# Altium schematic sheet NCS_Wireless_Control_Card_Display_Connector.SchDoc
size A
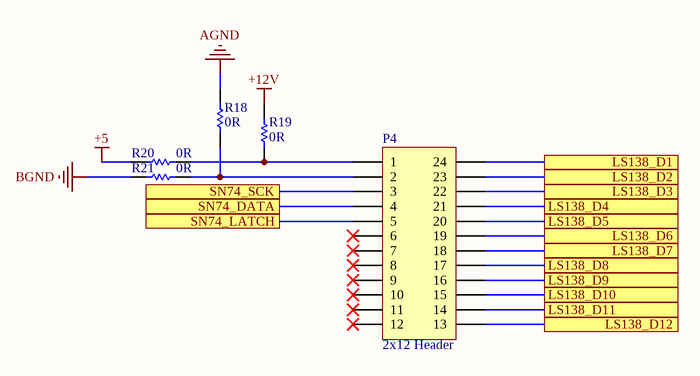
[diagram p0: NCS_Wireless_Control_Card_Display_Connector.SchDoc]

## Parts
P4  2x12 Header  [2x12 header]
R18  0R  [RC0805FR-7W330RL]
R19  0R  [RC0805FR-7W330RL]
R20  0R  [RC0805FR-7W330RL]
R21  0R  [RC0805FR-7W330RL]

## Ports
LS138_D1, LS138_D2, LS138_D3, LS138_D4, LS138_D5, LS138_D6, LS138_D7, LS138_D8, LS138_D9, LS138_D10, LS138_D11, LS138_D12, SN74_DATA, SN74_LATCH, SN74_SCK

## Nets
+5: R20.2
+12V: R19.2
AGND: R18.2
BGND: R21.2
LS138_D1: P4.24 ; port LS138_D1
LS138_D2: P4.23 ; port LS138_D2
LS138_D3: P4.22 ; port LS138_D3
LS138_D4: P4.21 ; port LS138_D4
LS138_D5: P4.20 ; port LS138_D5
LS138_D6: P4.19 ; port LS138_D6
LS138_D7: P4.18 ; port LS138_D7
LS138_D8: P4.17 ; port LS138_D8
LS138_D9: P4.16 ; port LS138_D9
LS138_D10: P4.15 ; port LS138_D10
LS138_D11: P4.14 ; port LS138_D11
LS138_D12: P4.13 ; port LS138_D12
SN74_DATA: P4.4 ; port SN74_DATA
SN74_LATCH: P4.5 ; port SN74_LATCH
SN74_SCK: P4.3 ; port SN74_SCK
NetP4_1: P4.1 R19.1 R20.1
NetP4_2: P4.2 R18.1 R21.1

Not connected (* = marked no-connect by the designer): P4 6* 7* 8* 9* 10* 11* 12*

## Library data of the parts
P4 = 0702462401: 2.54mm Pitch C-Grid Header Low Profile Dual Row Vertical Shrouded 24 Circuits 0.38; Manufacturer: Molex; Supplier: Mouser; Supplier Part Number: 538-70246-2401; Manufacturer Part Number: 0702462401; RoHS: Yes; Stock: 1024; Pricing: 1=2.2, 10=1.67, 50=1.67, 100=1.31, 1000=1.31, 10000=1.29 (USD); ComponentLink1URL: https://datasheet.ciiva.com/9470/0702462401-pcb-headers-9470294.pdf?src-supplier=Avnet; ComponentLink1Description: https://datasheet.ciiva.com/9470/0702462401-pcb-headers-9470294.pdf?src-supplier=Avnet
R18-R21 = RC0805FR-7W330RL: Res Thick Film 0805 330 Ohm 1% 0.25W(1/4W) ±200ppm/C Pad SMD T/R; Manufacturer: Yageo; Value: 330R; Supplier: Digikey; Supplier Part Number: 13-RC0805FR-7W330RLCT-ND; Manufacturer Part Number: RC0805FR-7W330RL; RoHS: Yes; Category: Chip SMD Resistors; Stock: 5595; Pricing: 1=0.17, 10=0.057, 50=0.046, 100=0.0347, 500=0.03264, 1000=0.0306 (USD); Case/Package: 339Case; Packaging: 10Packaging